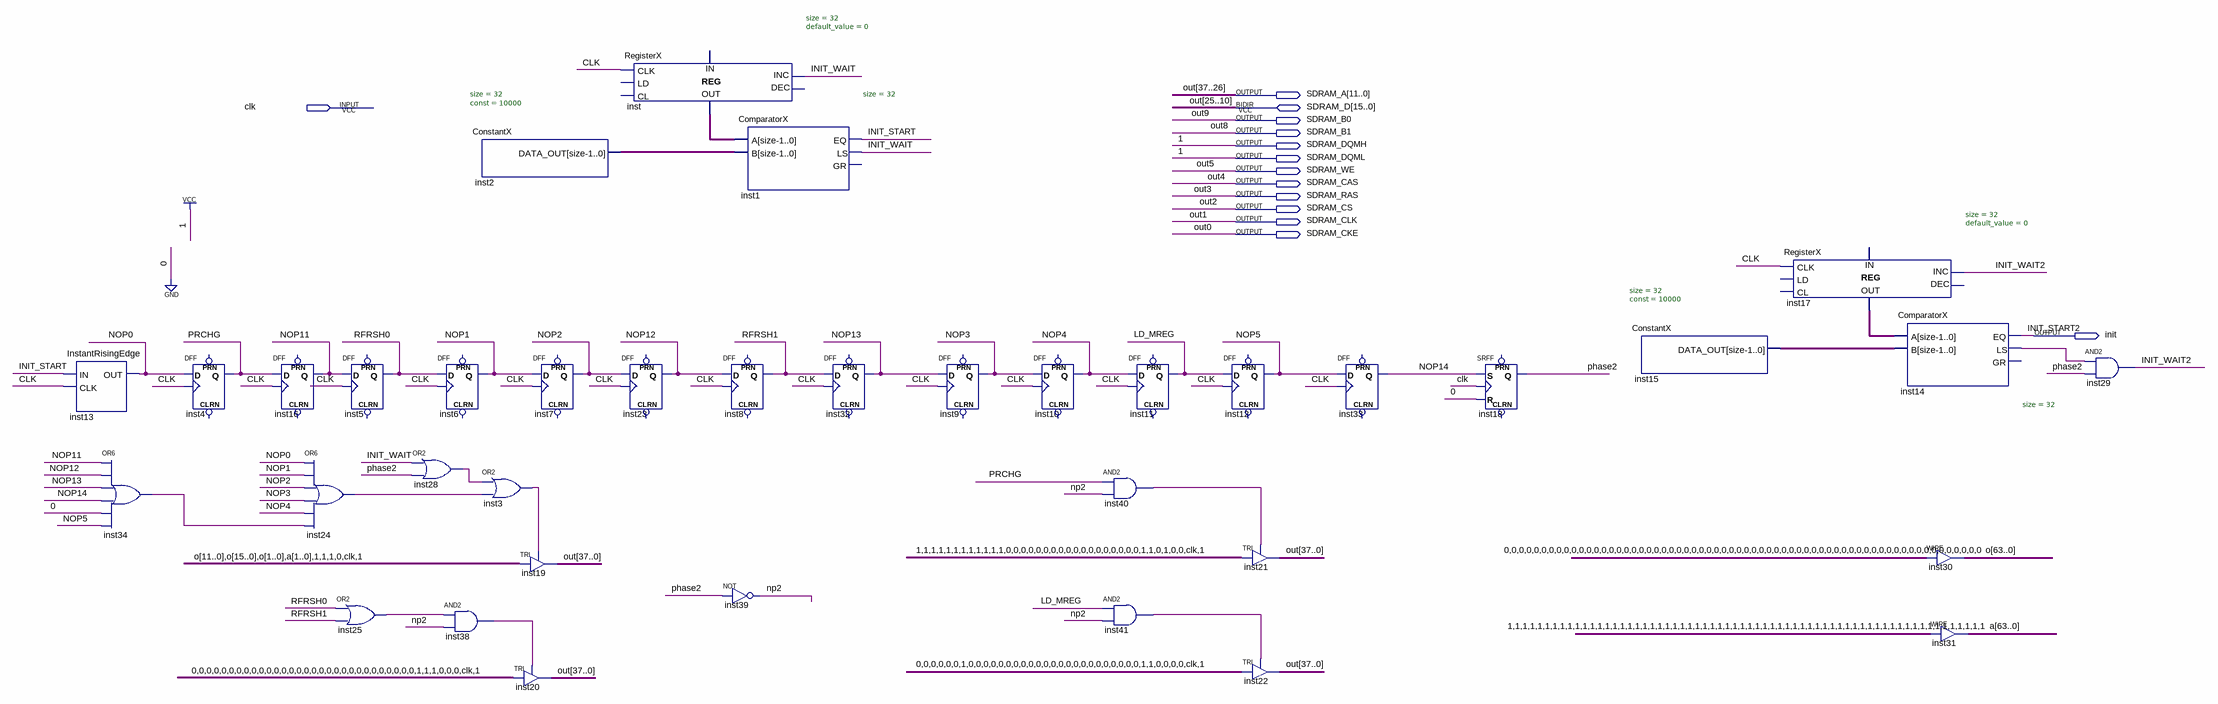
[diagram p0: schematic sheet]
// Quartus schematic initSDRAM.bdf as structural Verilog: 37 symbols, 14 pins
module initSDRAM (
  input  clk,
  inout  [15:0] SDRAM_D,
  output [11:0] SDRAM_A,
  output SDRAM_B0,
  output SDRAM_B1,
  output SDRAM_DQMH,
  output SDRAM_DQML,
  output SDRAM_WE,
  output SDRAM_CAS,
  output SDRAM_RAS,
  output SDRAM_CS,
  output SDRAM_CLK,
  output SDRAM_CKE,
  output init
);

  wire INIT_START, INIT_WAIT, INIT_WAIT2, inst3_out, inst14_ls, inst24_out, inst25_out, inst28_out,
       inst34_out, inst38_out, inst40_out, inst41_out, LD_MREG, NOP0, NOP1, NOP2, NOP3, NOP4, NOP5, NOP11,
       NOP12, NOP13, NOP14, np2, phase2, PRCHG, RFRSH0, RFRSH1;
  wire [7:6] out;
  wire [31:0] inst2_data_out, inst15_data_out, inst17_data_out, inst_data_out;
  wire [63:0] a, o;

  InstantRisingEdge inst13 (.IN(INIT_START), .CLK(clk), .OUT(NOP0));
  or inst34 (inst34_out, NOP11, NOP12, NOP13, NOP14, 1'b0, NOP5);
  DFF inst4 (.CLK(clk), .D(NOP0), .Q(PRCHG));  // open: CLRN, PRN
  DFF inst16 (.CLK(clk), .D(PRCHG), .Q(NOP11));  // open: CLRN, PRN
  or inst24 (inst24_out, NOP0, NOP1, NOP2, NOP3, NOP4, inst34_out);
  DFF inst5 (.CLK(clk), .D(NOP11), .Q(RFRSH0));  // open: CLRN, PRN
  or inst25 (inst25_out, RFRSH0, RFRSH1);
  or inst28 (inst28_out, INIT_WAIT, phase2);
  ConstantX #(.size(32), .\const (10000)) inst2 (.DATA_OUT(inst2_data_out));
  DFF inst6 (.CLK(clk), .D(RFRSH0), .Q(NOP1));  // open: CLRN, PRN
  and inst38 (inst38_out, inst25_out, np2);
  or inst3 (inst3_out, inst28_out, inst24_out);
  TRI inst19[37:0] (
    .IN({o[11:0], o[15:0], o[1:0], a[1:0], 4'b1110, clk, 1'b1}), .OE(inst3_out),
    .OUT({SDRAM_A, SDRAM_D, SDRAM_B0, SDRAM_B1, out, SDRAM_WE, SDRAM_CAS, SDRAM_RAS, SDRAM_CS, SDRAM_CLK, SDRAM_CKE}));
  TRI inst20[37:0] (
    .IN({36'b000000000000000000000000000000111000, clk, 1'b1}), .OE(inst38_out),
    .OUT({SDRAM_A, SDRAM_D, SDRAM_B0, SDRAM_B1, out, SDRAM_WE, SDRAM_CAS, SDRAM_RAS, SDRAM_CS, SDRAM_CLK, SDRAM_CKE}));
  DFF inst7 (.CLK(clk), .D(NOP1), .Q(NOP2));  // open: CLRN, PRN
  RegisterX #(.size(32), .default_value(0)) inst (
    .CLK(clk), .INC(INIT_WAIT), .DATA_OUT(inst_data_out));  // open: LD, CL, DEC, DATA_IN
  DFF inst23 (.CLK(clk), .D(NOP2), .Q(NOP12));  // open: CLRN, PRN
  DFF inst8 (.CLK(clk), .D(NOP12), .Q(RFRSH1));  // open: CLRN, PRN
  not inst39 (np2, phase2);
  ComparatorX #(.size(32)) inst1 (.A(inst_data_out), .B(inst2_data_out), .EQ(INIT_START), .LS(INIT_WAIT));  // open: GR
  DFF inst32 (.CLK(clk), .D(RFRSH1), .Q(NOP13));  // open: CLRN, PRN
  DFF inst9 (.CLK(clk), .D(NOP13), .Q(NOP3));  // open: CLRN, PRN
  DFF inst10 (.CLK(clk), .D(NOP3), .Q(NOP4));  // open: CLRN, PRN
  DFF inst11 (.CLK(clk), .D(NOP4), .Q(LD_MREG));  // open: CLRN, PRN
  and inst40 (inst40_out, PRCHG, np2);
  and inst41 (inst41_out, LD_MREG, np2);
  DFF inst12 (.CLK(clk), .D(LD_MREG), .Q(NOP5));  // open: CLRN, PRN
  TRI inst21[37:0] (
    .IN({36'b111111111111000000000000000000110100, clk, 1'b1}), .OE(inst40_out),
    .OUT({SDRAM_A, SDRAM_D, SDRAM_B0, SDRAM_B1, out, SDRAM_WE, SDRAM_CAS, SDRAM_RAS, SDRAM_CS, SDRAM_CLK, SDRAM_CKE}));
  TRI inst22[37:0] (
    .IN({36'b000000100000000000000000000000110000, clk, 1'b1}), .OE(inst41_out),
    .OUT({SDRAM_A, SDRAM_D, SDRAM_B0, SDRAM_B1, out, SDRAM_WE, SDRAM_CAS, SDRAM_RAS, SDRAM_CS, SDRAM_CLK, SDRAM_CKE}));
  DFF inst33 (.CLK(clk), .D(NOP5), .Q(NOP14));  // open: CLRN, PRN
  SRFF inst18 (.S(NOP14), .R(1'b0), .CLK(clk), .Q(phase2));  // open: PRN, CLRN
  ConstantX #(.size(32), .\const (10000)) inst15 (.DATA_OUT(inst15_data_out));
  RegisterX #(.size(32), .default_value(0)) inst17 (
    .CLK(clk), .INC(INIT_WAIT2), .DATA_OUT(inst17_data_out));  // open: LD, CL, DEC, DATA_IN
  ComparatorX #(.size(32)) inst14 (.A(inst17_data_out), .B(inst15_data_out), .EQ(init), .LS(inst14_ls));  // open: GR
  assign o = {64{1'b0}};  // WIRE inst30
  assign a = {64{1'b1}};  // WIRE inst31
  and inst29 (INIT_WAIT2, inst14_ls, phase2);

  assign SDRAM_DQMH = 1'b1;
  assign SDRAM_DQML = 1'b1;

  // Other names for the same wires on the sheet: INIT_START2 = init;
  //   out (some bits) = {SDRAM_A, SDRAM_D, SDRAM_B0, SDRAM_B1, SDRAM_WE, SDRAM_CAS, SDRAM_RAS, SDRAM_CS, SDRAM_CLK, SDRAM_CKE};
  //   out0 = SDRAM_CKE; out1 = SDRAM_CLK; out2 = SDRAM_CS; out3 = SDRAM_RAS; out4 = SDRAM_CAS; out5 = SDRAM_WE;
  //   out8 = SDRAM_B1; out9 = SDRAM_B0
endmodule
